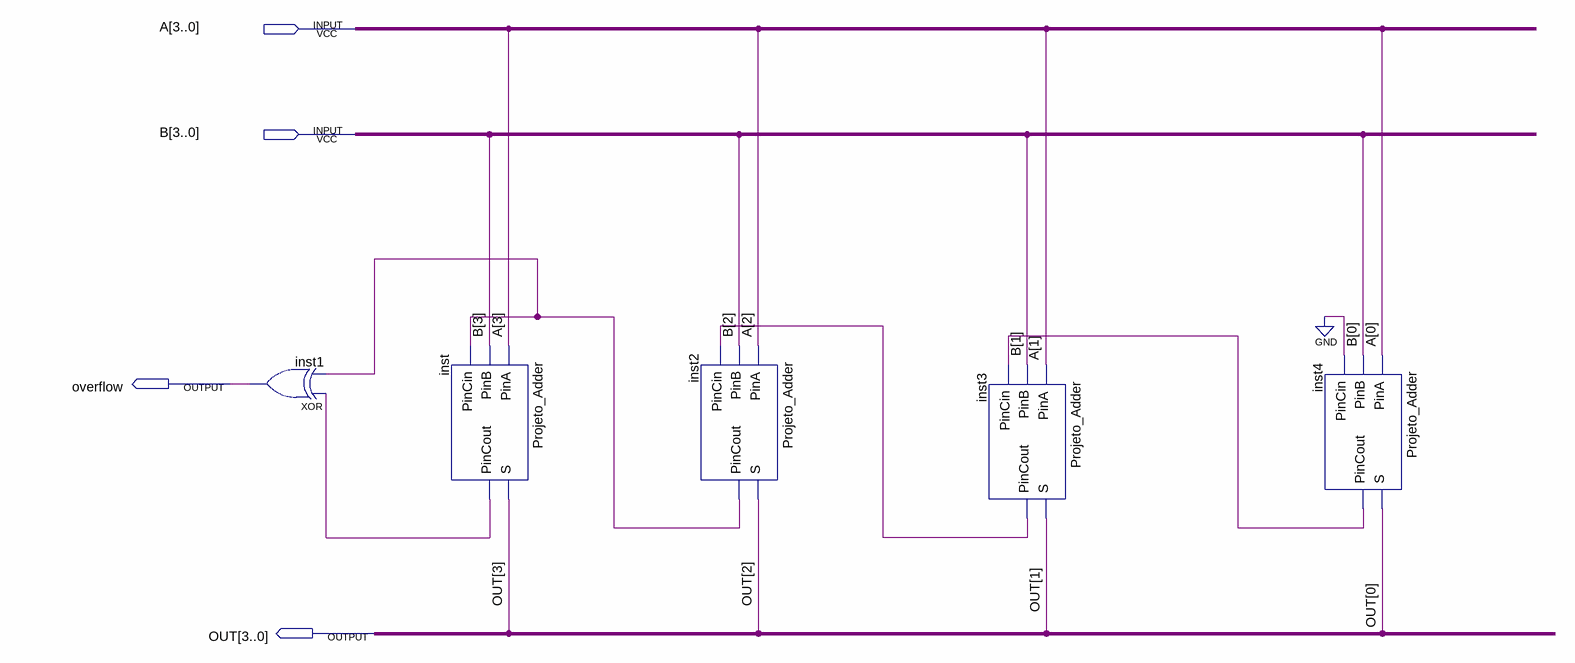
[diagram p0: schematic sheet]
// Quartus schematic Full_Adder.bdf as structural Verilog: 5 symbols, 4 pins
module Full_Adder (
  input  [3:0] A,
  input  [3:0] B,
  output overflow,
  output [3:0] OUT
);

  wire inst2_pincout, inst3_pincout, inst4_pincout, inst_pincout;

  xor inst1 (overflow, inst_pincout, inst2_pincout);
  Projeto_Adder inst (.PinA(A[3]), .PinB(B[3]), .PinCin(inst2_pincout), .S(OUT[3]), .PinCout(inst_pincout));
  Projeto_Adder inst2 (.PinA(A[2]), .PinB(B[2]), .PinCin(inst3_pincout), .S(OUT[2]), .PinCout(inst2_pincout));
  Projeto_Adder inst3 (.PinA(A[1]), .PinB(B[1]), .PinCin(inst4_pincout), .S(OUT[1]), .PinCout(inst3_pincout));
  Projeto_Adder inst4 (.PinA(A[0]), .PinB(B[0]), .PinCin(1'b0), .S(OUT[0]), .PinCout(inst4_pincout));
endmodule
